# EAGLE design main (EAGLE 9.2.2)
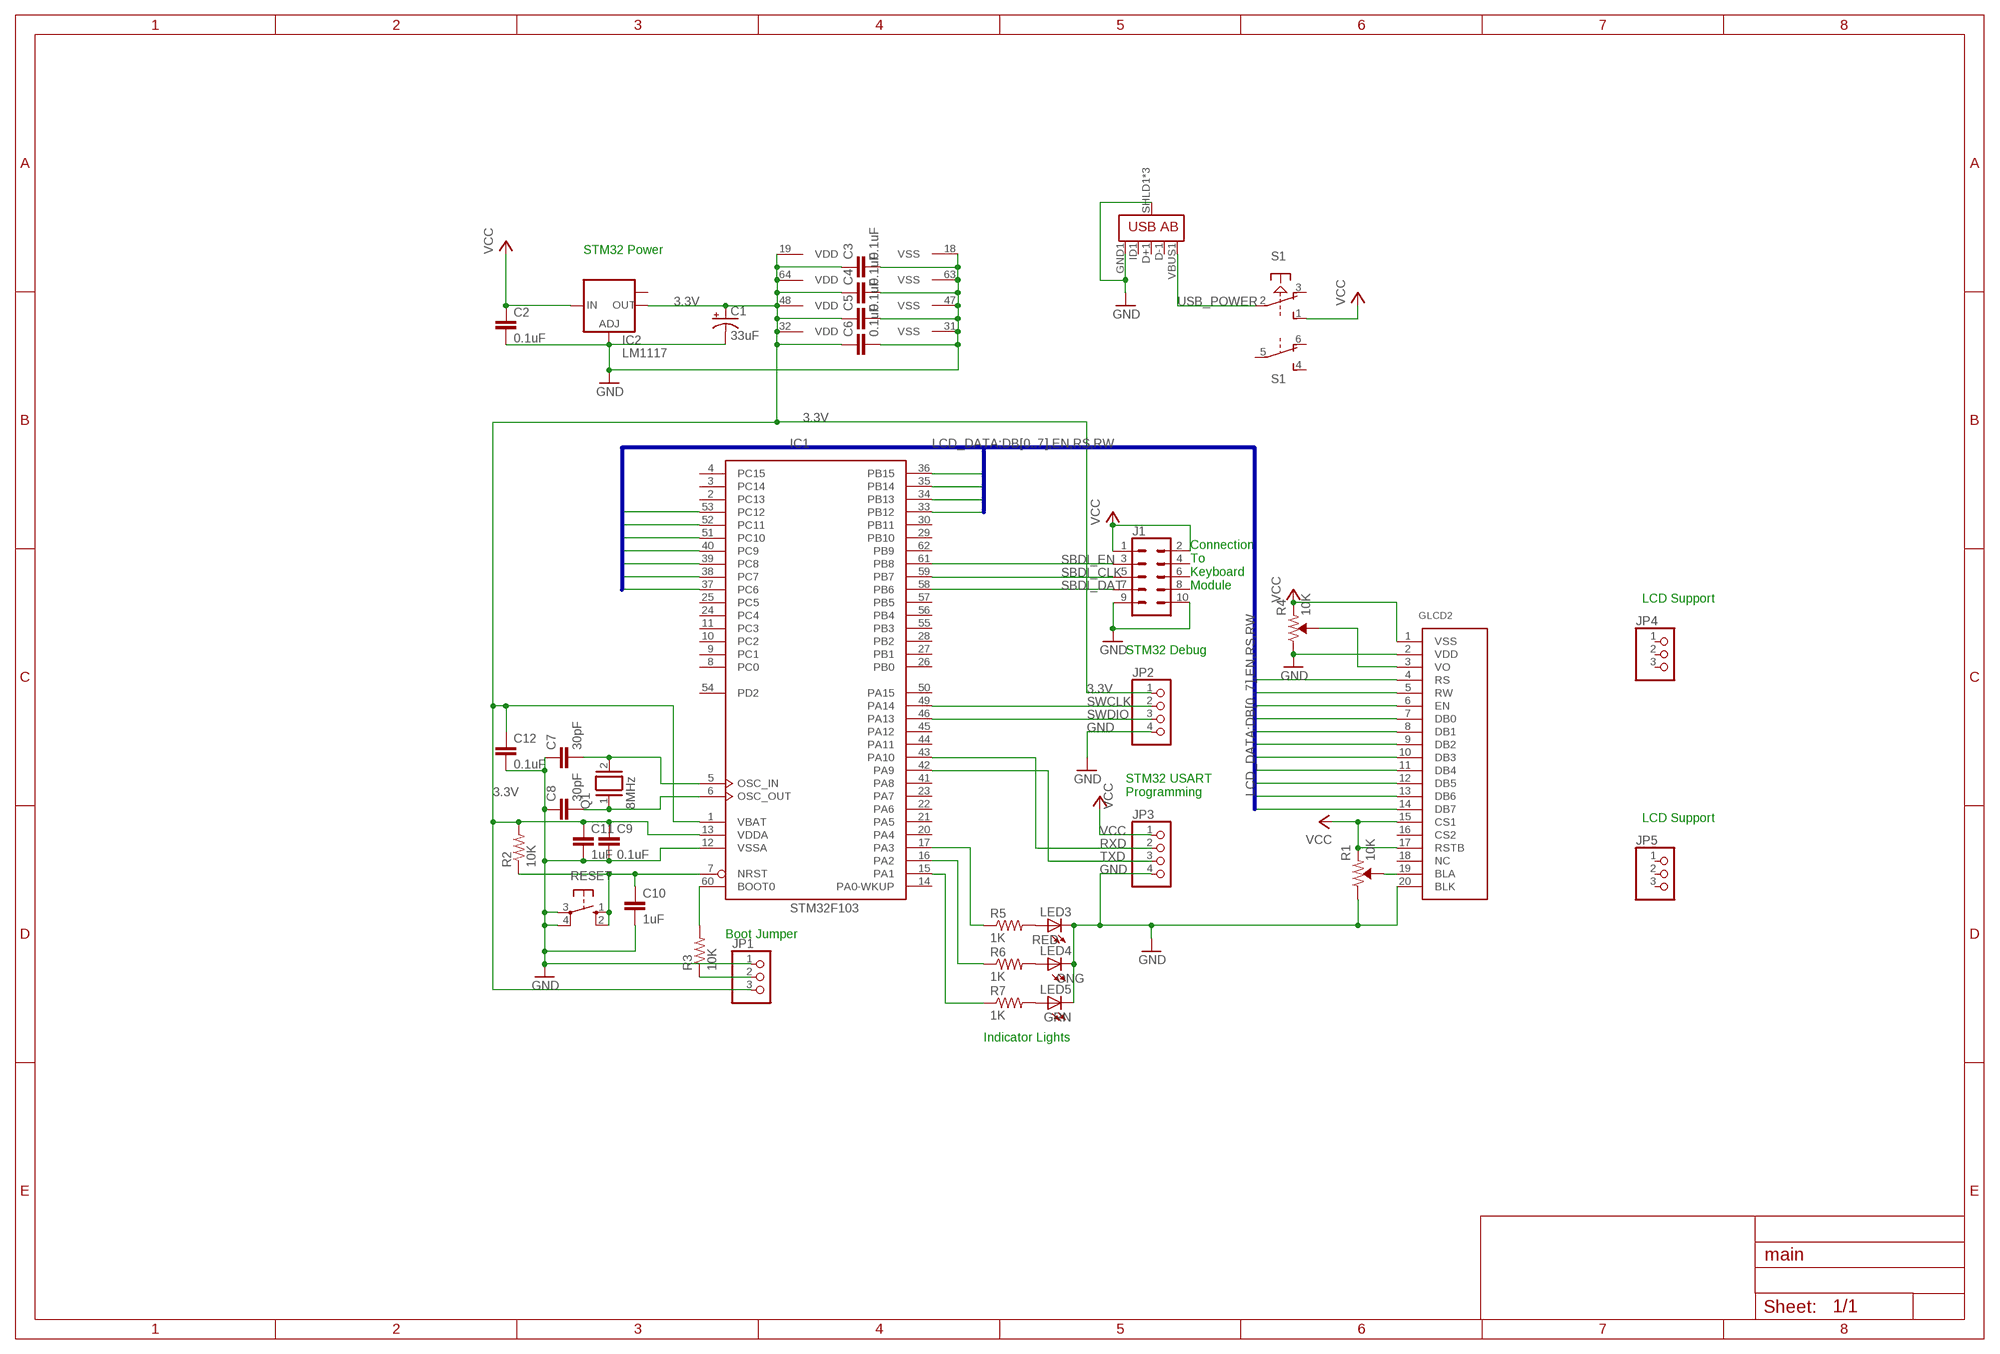
[diagram p0: schematic, sheet 1]

## Parts
C1  33uF  CPOL-USE2-5  [E2-5]
C2  0.1uF  C-EU025-025X050  [C025-025X050]
C3  0.1uF  C-EU025-025X050  [C025-025X050]
C4  0.1uF  C-EU025-025X050  [C025-025X050]
C5  0.1uF  C-EU025-025X050  [C025-025X050]
C6  0.1uF  C-EU025-025X050  [C025-025X050]
C7  30pF  C-EU025-025X050  [C025-025X050]
C8  30pF  C-EU025-025X050  [C025-025X050]
C9  0.1uF  C-EU025-025X050  [C025-025X050]
C10  1uF  C-EU025-025X050  [C025-025X050]
C11  1uF  C-EU025-025X050  [C025-025X050]
C12  0.1uF  C-EU025-025X050  [C025-025X050]
GLCD2  LCD128X64  [GLCD_TRULY_128X64_20_PINES]
IC1  STM32F103  STM32F103RCT  [LQFP64]
IC2  LM1117  LM1117IMPX-ADJ  [SOT223]
J1  CONN_05X2SHD_LOCK  [2X5-SHROUDED_LOCK]
JP1  PINHD-1X3  [1X03]
JP2  PINHD-1X4  [1X04]
JP3  PINHD-1X4  [1X04]
JP4  PINHD-1X3  [1X03]
JP5  PINHD-1X3  [1X03]
LED3  RED  LED5MM  [LED5MM]
LED4  ONG  LED5MM  [LED5MM]
LED5  GRN  LED5MM  [LED5MM]
Q1  8MHz  XTAL/S  [QS]
R1  10K  TRIMPOT-KNOB  [TRIMPOT-PTH-3386U]
R2  10K  R-US_0204/7  [0204/7]
R3  10K  R-US_0204/7  [0204/7]
R4  10K  TRIMPOT-KNOB  [TRIMPOT-PTH-3386U]
R5  1K  R-US_0204/7  [0204/7]
R6  1K  R-US_0204/7  [0204/7]
R7  1K  R-US_0204/7  [0204/7]
RESET  10-XX  [B3F-10XX]
S1  PVA2R  [PVA2R]
U1  USB_AB_SMT  [USB-AB-MICRO-SMD]

## Nets
3.3V: C1.+ C3.1 C4.1 C5.1 C6.1 C9.1 C11.1 C12.1 IC1.1(VBAT) IC1.13(VDDA) IC1.19(VDD) IC1.32(VDD) IC1.48(VDD) IC1.64(VDD) IC2.2(OUT) JP1.3 JP2.1 R2.2
DB0: GLCD2.7(DB0) IC1.33(PB12)
DB1: GLCD2.8(DB1) IC1.34(PB13)
DB2: GLCD2.9(DB2) IC1.35(PB14)
DB3: GLCD2.10(DB3) IC1.36(PB15)
DB4: GLCD2.11(DB4) IC1.37(PC6)
DB5: GLCD2.12(DB5) IC1.38(PC7)
DB6: GLCD2.13(DB6) IC1.39(PC8)
DB7: GLCD2.14(DB7) IC1.40(PC9)
EN: GLCD2.6(EN) IC1.53(PC12)
GND: C1.- C2.2 C3.2 C4.2 C5.2 C6.2 C7.1 C8.1 C9.2 C10.2 C11.2 C12.2 GLCD2.2(VDD) GLCD2.20(BLK) IC1.12(VSSA) IC1.18(VSS) IC1.31(VSS) IC1.47(VSS) IC1.63(VSS) IC2.1(ADJ) J1.9 J1.10 JP1.1 JP2.4 JP3.4 LED3.K(C) LED4.K(C) LED5.K(C) R1.1 R4.1 RESET.3(P) RESET.4(P1) U1.GND1(GND) U1.SHLD1(SHIELD) U1.SHLD2(SHIELD) U1.SHLD3(SHIELD)
N$1: GLCD2.19(BLA) R1.2
N$2: GLCD2.3(VO) R4.2
N$3: LED3.A R5.2
N$4: LED4.A R6.2
N$5: C7.2 IC1.5(OSC_IN) Q1.2
N$6: C10.1 IC1.7(NRST) R2.1 RESET.1(S) RESET.2(S1)
N$7: C8.2 IC1.6(OSC_OUT) Q1.1
N$9: IC1.15(PA1) R7.1
N$10: IC1.60(BOOT0) R3.2
N$11: JP1.2 R3.1
N$13: IC1.16(PA2) R6.1
N$14: IC1.17(PA3) R5.1
N$15: LED5.A R7.2
RS: GLCD2.4(RS) IC1.51(PC10)
RW: GLCD2.5(RW) IC1.52(PC11)
RXD: IC1.43(PA10) JP3.2
SBDI_CLK: IC1.59(PB7) J1.5
SBDI_DAT: IC1.58(PB6) J1.7
SBDI_EN: IC1.61(PB8) J1.3
SWCLK: IC1.49(PA14) JP2.2
SWDIO: IC1.46(PA13) JP2.3
TXD: IC1.42(PA9) JP3.3
USB_POWER: S1.2(1:P) U1.VBUS1(VBUS)
VCC: C2.1 GLCD2.1(VSS) GLCD2.15(CS1) GLCD2.17(RSTB) IC2.3(IN) J1.1 J1.2 JP3.1 R1.3 R4.3 S1.1(1:S)
Unconnected: GLCD2.16(CS2) GLCD2.18(NC) IC1.2(PC13) IC1.3(PC14) IC1.4(PC15) IC1.8(PC0) IC1.9(PC1) IC1.10(PC2) IC1.11(PC3) IC1.14(PA0-WKUP) IC1.20(PA4) IC1.21(PA5) IC1.22(PA6) IC1.23(PA7) IC1.24(PC4) IC1.25(PC5) IC1.26(PB0) IC1.27(PB1) IC1.28(PB2) IC1.29(PB10) IC1.30(PB11) IC1.41(PA8) IC1.44(PA11) IC1.45(PA12) IC1.50(PA15) IC1.54(PD2) IC1.55(PB3) IC1.56(PB4) IC1.57(PB5) IC1.62(PB9) IC2.TAB(OUT1) J1.4 J1.6 J1.8 JP4.1 JP4.2 JP4.3 JP5.1 JP5.2 JP5.3 S1.3(1:O) S1.4(2:S) S1.5(2:P) S1.6(2:O) U1.D+1(D+) U1.D-1(D-) U1.ID1(USBID)

## Buses
LCD_DATA:DB[0..7],EN,RS,RW

## Notes on the sheet
- STM32 Power
- Connection
  To
  Keyboard
  Module
- LCD Support
- STM32 Debug
- STM32 USART
  Programming
- LCD Support
- Boot Jumper
- Indicator Lights

## Library data of the parts
C1 = rcl:CPOL-US: POLARIZED CAPACITOR, American symbol; SPICEPREFIX: C
C2-C12 = rcl:C-EU: CAPACITOR, European symbol; SPICEPREFIX: C
GLCD2 = glcd_truly_128x64_20_pines:LCD128X64
IC1 = micro-stm_v3:STM32F103R*T: ARM 32-bit Cortex™-M3 CPU 72 MHz maximum frequency 16 to 1024 Kbytes of Flash memory 6 to 96 kbytes of SRAM 51 GPIOs 2.0 to 3.6 V application supply
IC2 = lm1117:LM1117IMPX-ADJ
J1 = SparkFun-Connectors:CONN_05X2: Multi connection point. Often used as Generic Header-pin footprint for 0.1 inch spaced/style header connections For AVR SPI programming port, see special device with nice symbol: "AVR_SPI_PROG_5x2.dev" You can populate with any combo of single row headers, but if you'd like an exact match, check these: 2x5 AVR ICSP Male Header <https://www.sparkfun.com/products/778> (PRT-00778) 2x5 Pin Shrouded Header <https://www.sparkfun.com/products/8506> (PRT-08506) On any of the 0.1 inch spaced packages, you can populate with these: Break Away Headers - Straight <https://www.sparkfun.com/products/116> (PRT-00116) Break Away Male Headers - Right Angle <https://www.sparkfun.com/products/553> (PRT-00553) Female Headers <https://www.sparkfun.com/products/115> (PRT-00115) Break Away Headers - Machine Pin <https://www.sparkfun.com/products/117> (PRT-00117) Break Away Female Headers - Swiss Machine Pin <https://www.sparkfun.com/products/743> (PRT-00743) Special note: the shrouded connector mates well with our 5x2 ribbon cables: 2x5 Pin IDC Ribbon Cable <https://www.sparkfun.com/products/8535> (PRT-08535); PROD_ID: CONN-08671; SF_ID: PRT-08506
JP1 JP4 JP5 = pinhead:PINHD-1X3: PIN HEADER
JP2 JP3 = pinhead:PINHD-1X4: PIN HEADER
LED3-LED5 = led:LED: LED OSRAM: - CHIPLED LG R971, LG N971, LY N971, LG Q971, LY Q971, LO R971, LY R971 LH N974, LH R974 LS Q976, LO Q976, LY Q976 LO Q996 - Hyper CHIPLED LW Q18S LB Q993, LB Q99A, LB R99A - SideLED LS A670, LO A670, LY A670, LG A670, LP A670 LB A673, LV A673, LT A673, LW A673 LH A674 LY A675 LS A676, LA A676, LO A676, LY A676, LW A676 LS A679, LY A679, LG A679 - Hyper Micro SIDELED® LS Y876, LA Y876, LO Y876, LY Y876 LT Y87S - SmartLED LW L88C, LW L88S LB L89C, LB L89S, LG L890 LS L89K, LO L89K, LY L89K LS L896, LA L896, LO L896, LY L896 - TOPLED LS T670, LO T670, LY T670, LG T670, LP T670 LSG T670, LSP T670, LSY T670, LOP T670, LYG T670 LG T671, LOG T671, LSG T671 LB T673, LV T673, LT T673, LW T673 LH T674 LS T676, LA T676, LO T676, LY T676, LB T676, LH T676, LSB T676, LW T676 LB T67C, LV T67C, LT T67C, LS T67K, LO T67K, LY T67K, LW E67C LS E67B, LA E67B, LO E67B, LY E67B, LB E67C, LV E67C, LT E67C LW T67C LS T679, LY T679, LG T679 LS T770, LO T770, LY T770, LG T770, LP T770 LB T773, LV T773, LT T773, LW T773 LH T774 LS E675, LA E675, LY E675, LS T675 LS T776, LA T776, LO T776, LY T776, LB T776 LHGB T686 LT T68C, LB T68C - Hyper Mini TOPLED® LB M676 - Mini TOPLED Santana® LG M470 LS M47K, LO M47K, LY M47K Source: http://www.osram.convergy.de LUXEON: - LUMILED® LXK2-PW12-R00, LXK2-PW12-S00, LXK2-PW14-U00, LXK2-PW14-V00 LXK2-PM12-R00, LXK2-PM12-S00, LXK2-PM14-U00 LXK2-PE12-Q00, LXK2-PE12-R00, LXK2-PE12-S00, LXK2-PE14-T00, LXK2-PE14-U00 LXK2-PB12-K00, LXK2-PB12-L00, LXK2-PB12-M00, LXK2-PB14-N00, LXK2-PB14-P00, LXK2-PB14-Q00 LXK2-PR12-L00, LXK2-PR12-M00, LXK2-PR14-Q00, LXK2-PR14-R00 LXK2-PD12-Q00, LXK2-PD12-R00, LXK2-PD12-S00 LXK2-PH12-R00, LXK2-PH12-S00 LXK2-PL12-P00, LXK2-PL12-Q00, LXK2-PL12-R00 Source: www.luxeon.com KINGBRIGHT: KA-3528ASYC Source: www.kingbright.com
Q1 = special:XTAL/S: CRYSTAL
R1 R4 = TCalc:TRIMPOT-KNOB
R2 R3 R5-R7 = rcl:R-US_: RESISTOR, American symbol; SPICEPREFIX: R
RESET = switch-omron:10-XX: OMRON SWITCH; MPN: B3F-1000; OC_FARNELL: 176432; OC_NEWARK: 36M3542
S1 = switch-misc:PVA2R: ITT SWITCH
U1 = SparkFun-Connectors:USB_AB: USB Type AB Micro Connector OTG-compatible. 5 pins, 3 shield pins SparkFun Products: IOIO-OTG <https://www.sparkfun.com/products/13613> SparkFun SAMD21 Mini Breakout <https://www.sparkfun.com/products/13664>; PROD_ID: CONN-11794

## Board
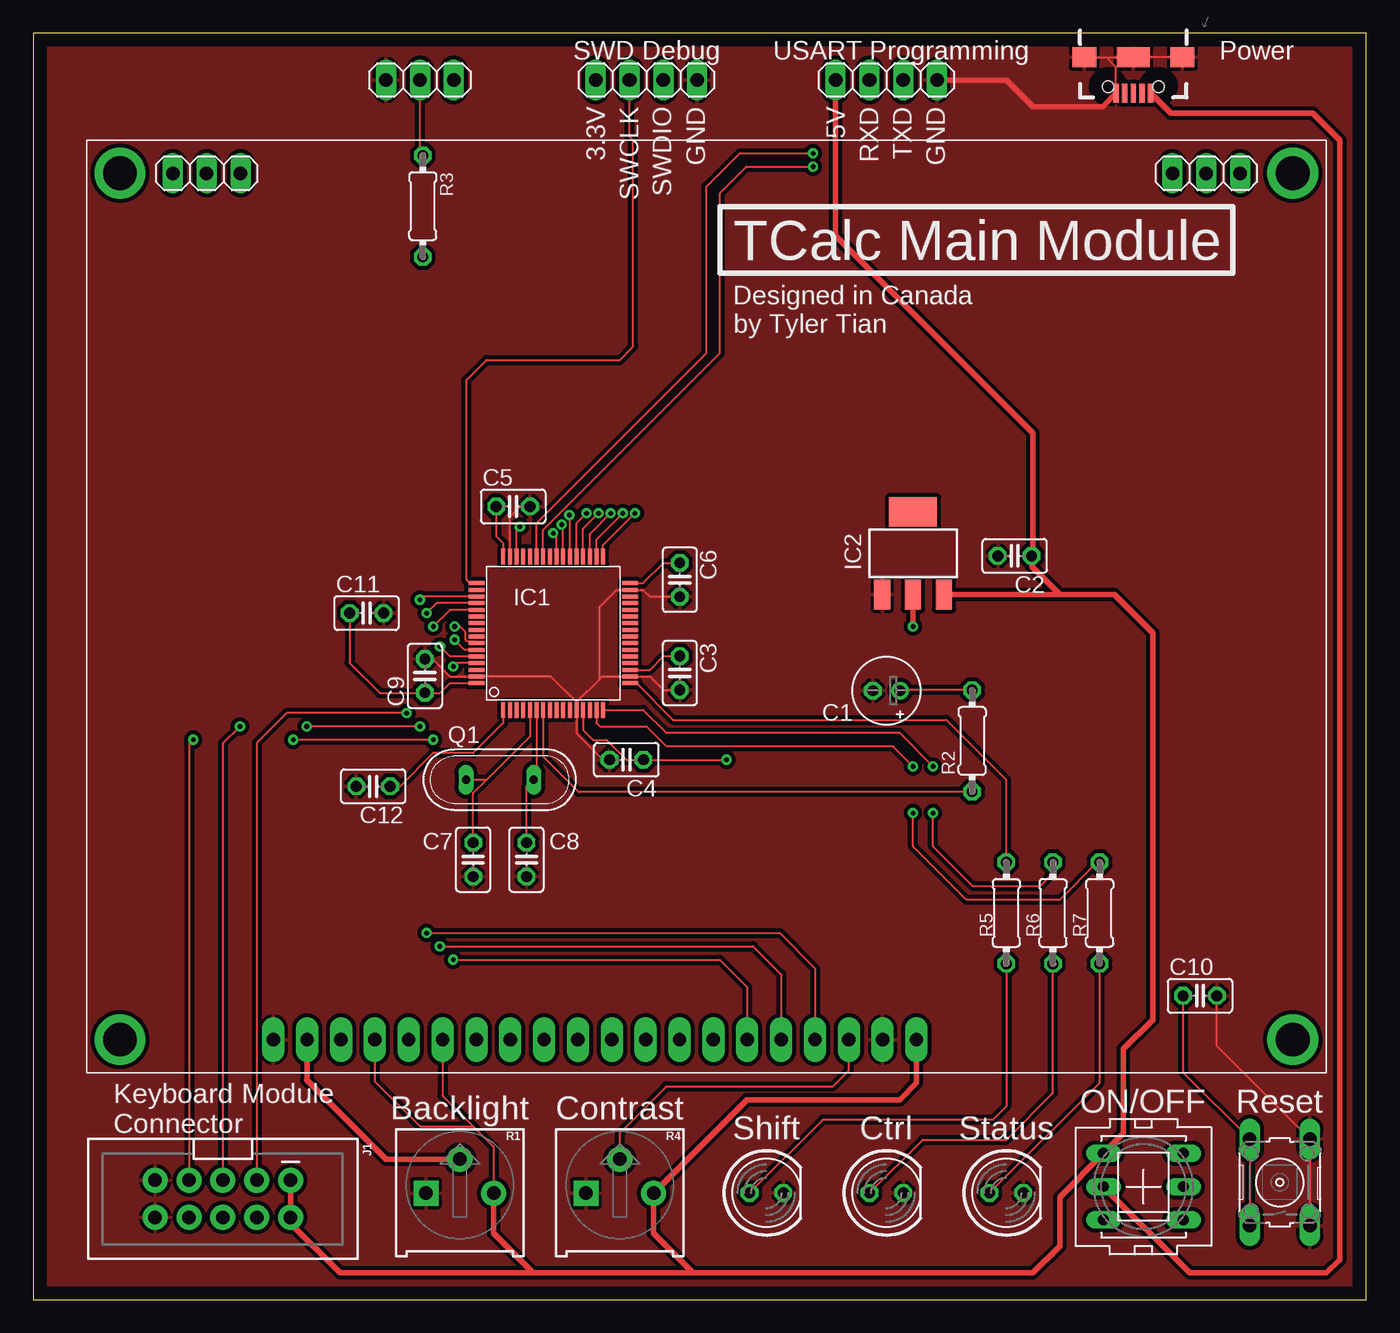
[diagram p1: board, top side]
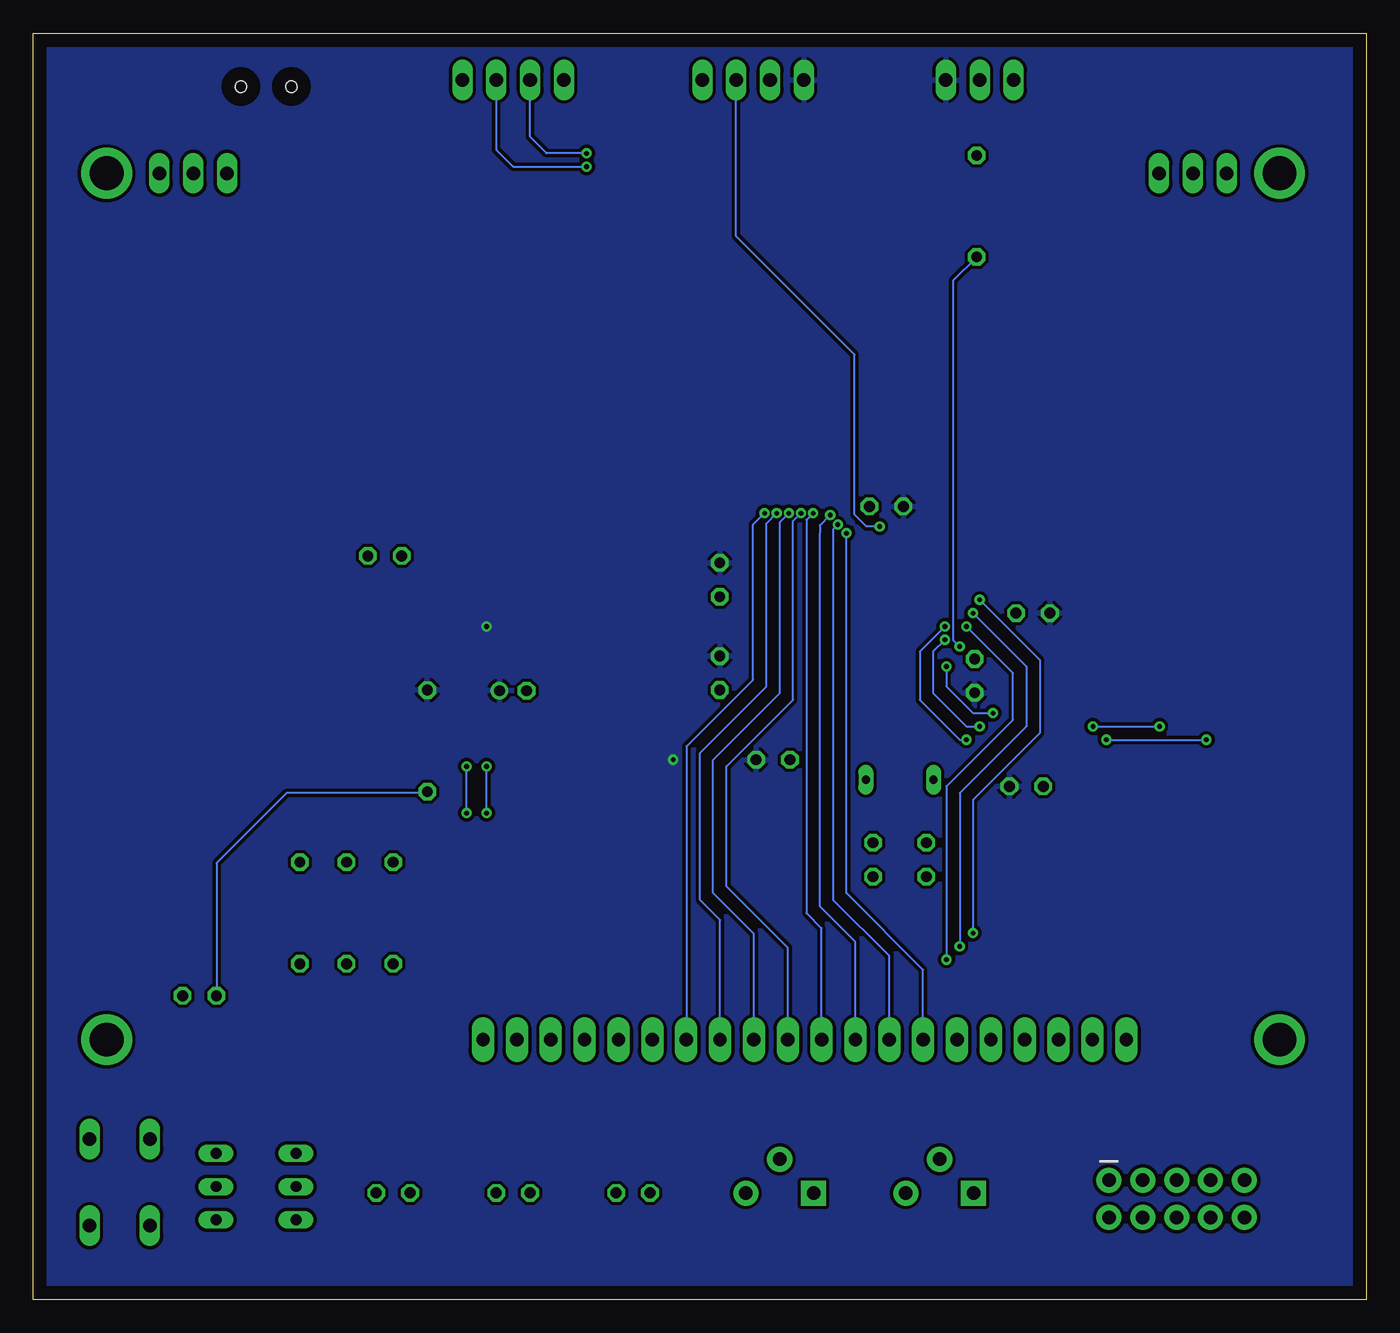
[diagram p2: board, bottom side, seen from below]

Size 100 x 95 mm. Coordinates in mm from the lower left corner, seen from the top.
Outline: 0,0 100,0 100,95 0,95 0,0
Copper layers (1*16): Top 0.035mm / dielectric 1.5mm / Bottom 0.035mm
Design rules "default": minimum track width 6mil, minimum drill 0.35mm, track to track 6mil, track to pad 6mil, pad to pad 6mil, via to via 6mil, smd to smd 6mil, copper to edge 40mil, drill to drill 6mil, minimum pad ring 10mil, minimum via ring 8mil, stop-mask expansion 4mil, vias tented up to drill 0mil, thermal gap 10mil

### Footprints (pad centres in the part's own frame; a part is rotated, then mirrored left to right if it is on the bottom)
E2-5 = drill 0.813 pad 1.27: + -1.016,0 | drill 0.813 pad 1.27 octagon: - 1.016,0
C025-025X050 = drill 0.813 octagon: 1 -1.27,0; 2 1.27,0
GLCD_TRULY_128X64_20_PINES = drill 1 pad 1.676 long: 1 62.26,2.5; 2 59.72,2.5; 3 57.18,2.5; 4 54.64,2.5; 5 52.1,2.5; 6 49.56,2.5; 7 47.02,2.5; 8 44.48,2.5; 9 41.94,2.5; 10 39.4,2.5; 11 36.86,2.5; 12 34.32,2.5; 13 31.78,2.5; 14 29.24,2.5; 15 26.7,2.5; 16 24.16,2.5; 17 21.62,2.5; 18 19.08,2.5; 19 16.54,2.5; 20 14,2.5 | drill 2.54 pad 3.81: P$21 2.5,2.5; P$22 90.5,2.5; P$23 90.5,67.5; P$24 2.5,67.5
LQFP64 = smd 0.3 x 1.2: 1 -3.75,-5.75; 2 -3.25,-5.75; 3 -2.75,-5.75; 4 -2.25,-5.75; 5 -1.75,-5.75; 6 -1.25,-5.75; 7 -0.75,-5.75; 8 -0.25,-5.75; 9 0.25,-5.75; 10 0.75,-5.75; 11 1.25,-5.75; 12 1.75,-5.75; 13 2.25,-5.75; 14 2.75,-5.75; 15 3.25,-5.75; 16 3.75,-5.75; 33 3.75,5.75; 34 3.25,5.75; 35 2.75,5.75; 36 2.25,5.75; 37 1.75,5.75; 38 1.25,5.75; 39 0.75,5.75; 40 0.25,5.75; 41 -0.25,5.75; 42 -0.75,5.75; 43 -1.25,5.75; 44 -1.75,5.75; 45 -2.25,5.75; 46 -2.75,5.75; 47 -3.25,5.75; 48 -3.75,5.75 | smd 1.2 x 0.3: 17 5.75,-3.75; 18 5.75,-3.25; 19 5.75,-2.75; 20 5.75,-2.25; 21 5.75,-1.75; 22 5.75,-1.25; 23 5.75,-0.75; 24 5.75,-0.25; 25 5.75,0.25; 26 5.75,0.75; 27 5.75,1.25; 28 5.75,1.75; 29 5.75,2.25; 30 5.75,2.75; 31 5.75,3.25; 32 5.75,3.75; 49 -5.75,3.75; 50 -5.75,3.25; 51 -5.75,2.75; 52 -5.75,2.25; 53 -5.75,1.75; 54 -5.75,1.25; 55 -5.75,0.75; 56 -5.75,0.25; 57 -5.75,-0.25; 58 -5.75,-0.75; 59 -5.75,-1.25; 60 -5.75,-1.75; 61 -5.75,-2.25; 62 -5.75,-2.75; 63 -5.75,-3.25; 64 -5.75,-3.75
SOT223 = smd 1.219 x 2.235: 1 -2.311,-3.099; 2 0,-3.099; 3 2.311,-3.099 | smd 3.6 x 2.2: TAB 0,3.099
2X5-SHROUDED_LOCK = drill 1.016 pad 1.88: 1 -1.397,5.08; 2 1.397,5.08; 3 -1.397,2.54; 4 1.397,2.54; 5 -1.397,0; 6 1.397,0; 7 -1.397,-2.54; 8 1.397,-2.54; 9 -1.397,-5.08; 10 1.397,-5.08
1X03 = drill 1.016 long: 1 -2.54,0; 2 0,0; 3 2.54,0
1X04 = drill 1.016 long: 1 -3.81,0; 2 -1.27,0; 3 1.27,0; 4 3.81,0
LED5MM = drill 0.813 octagon: A -1.27,0; K 1.27,0
QS = drill 0.61 long: 1 -2.54,0; 2 2.54,0
TRIMPOT-PTH-3386U = drill 1.016 pad 1.88 square: 1 -2.54,-0.015 | drill 1.016 pad 1.88: 2 0,2.525; 3 2.54,-0.015
0204/7 = drill 0.813 octagon: 1 -3.81,0; 2 3.81,0
B3F-10XX = drill 1.016 long: 1 -3.251,2.261; 2 3.251,2.261; 3 -3.251,-2.261; 4 3.251,-2.261
PVA2R = drill 0.813 long: 1 -2.997,2.489; 2 -2.997,0; 3 -2.997,-2.489; 4 2.997,2.489; 5 2.997,0; 6 2.997,-2.489
USB-AB-MICRO-SMD = smd 1.4 x 0.4: D+1 2.7,0; D-1 2.7,0.65; GND1 2.7,-1.3; ID1 2.7,-0.65; VBUS1 2.7,1.3 | smd 1.5 x 1.8: SHLD1 0,-3.68; SHLD2 0,3.68 | smd 1.5 x 2.5: SHLD3 0,0 | hole 0.85: 2.2,1.9; 2.2,-1.9

### Placement (x,y rotation side)
C1  64.01,45.68 180 top
C2  73.63,55.79 180 top
C3  48.5,47 270 top
C4  44.5,40.5 180 top
C5  36,59.5 0 top
C6  48.5,54 270 top
C7  33,33 90 top
C8  37,33 90 top
C9  29.38,46.79 90 top
C10  87.53,22.79 0 top
C11  25,51.5 0 top
C12  25.5,38.5 180 top
GLCD2  4,17 0 top
IC1  39,50 0 top
IC2  66,56 0 top
J1  14.22,7.55 270 top
JP1  29,91.5 0 top
JP2  46,91.5 0 top
JP3  64,91.5 0 top
JP4  88,84.5 0 top
JP5  13,84.5 0 top
LED3  55,8 0 top
LED4  64,8 0 top
LED5  73,8 0 top
Q1  35,39 180 top
R1  32,8 0 top
R2  70.44,41.91 90 top
R3  29.22,82.03 270 top
R4  44,8 0 top
R5  73,29 270 top
R6  76.5,29 270 top
R7  80,29 270 top
RESET  93.52,8.79 90 top
S1  83.29,8.47 0 top
U1  82.53,93.2 270 top

### Tracks (layer width: path | path; a pad name or v marks a point on that pad's centre or on a via)
3.3V  (via drill 0.35)
  Top 0.152: IC1.32 45.75,53.75 47.27,55.27 C6.1 | IC1.19 46.25,47.25 47.27,48.27 C3.1 | C5.1 34.73,57.27 35.25,56.75 IC1.48 | IC1.64 31.25,46.25 30.52,45.52 29.5,45.52 | IC1.13 41.25,42.75 42,42 43,42 44.5,40.5 C4.1 v52,40.5 | R2.2 65.07,45.72 C1.+ | IC1.1 35.25,43.25 33,41 30,41 27.5,38.5 C12.1 | C9.1 29.5,45.52 | C11.1 23.73,47.77 26,45.5 29.48,45.5 29.5,45.52
  Top 0.4: IC2.2 v66,50.5
  pour Bottom (isolate 0.25): 0,95 100,95 100,0 0,0
DB0  (via drill 0.35)
  Top 0.152: IC1.33 42.75,56.62 v45.13,59
  Bottom 0.152: v45.13,59 46,58.13 46,46.5 51,41.5 51,19.52 GLCD2.7
DB1  (via drill 0.35)
  Top 0.152: IC1.34 42.25,57.02 v44.23,59
  Bottom 0.152: GLCD2.8 48.48,28.48 50,30 50,41 45,46 45,58.23 v44.23,59
DB2  (via drill 0.35)
  Top 0.152: IC1.35 41.75,57.43 v43.32,59
  Bottom 0.152: GLCD2.9 45.94,27.44 49,30.5 49,40.5 44,45.5 44,58.32 v43.32,59
DB3  (via drill 0.35)
  Top 0.152: IC1.36 41.25,57.84 v42.41,59
  Bottom 0.152: GLCD2.10 43.4,26.4 48,31 48,40 43,45 43,58.41 v42.41,59
DB4  (via drill 0.35)
  Top 0.152: IC1.37 40.75,58.25 v41.5,59
  Bottom 0.152: v41.5,59 42,58.5 42,29 40.86,27.86 GLCD2.11
DB5  (via drill 0.35)
  Top 0.152: IC1.38 40.25,58.82 v40.21,58.86
  Bottom 0.152: GLCD2.12 38.32,26.82 41,29.5 41,57.5 41,58.07 v40.21,58.86
DB6  (via drill 0.35)
  Top 0.152: IC1.39 39.75,58.03 v39.64,58.14
  Bottom 0.152: GLCD2.13 35.78,25.78 40,30 40,57.78 v39.64,58.14
DB7  (via drill 0.35)
  Top 0.152: IC1.40 39.25,57.25 v39,57.5
  Bottom 0.152: GLCD2.14 33.24,24.74 39,30.5 v39,57.5
EN  (via drill 0.35)
  Top 0.152: IC1.53 31.25,51.75 v30,50.5 | GLCD2.6 53.56,23.44 51.5,25.5 v31.5,25.5
  Bottom 0.152: v30,50.5 26.5,47 26.5,43.5 31.5,38.5 v31.5,25.5
GND
  Top 0.152: RESET.3 RESET.4 88.8,19.02 C10.2 | C6.2 46.27,52.73 45.75,53.25 IC1.31 43.75,53.25 42.46,51.96 42.46,46.54 | C3.2 47.27,45.73 46.25,46.75 IC1.18 42.68,46.75 42.46,46.54 | IC1.47 35.75,58.75 36.5,59.5 C5.2 | C4.2 42.73,40.5 40.75,42.48 IC1.12 40.75,44.82 | C9.2 29.94,48.06 31.25,46.75 IC1.63 38.82,46.75 40.75,44.82 | U1.SHLD1 80.5,93.2 | 80.5,93.2 U1.SHLD3 U1.SHLD2 | U1.GND1 81.23,92.47 80.5,93.2 | 40.75,44.82 42.46,46.54
  Top 0.4: JP3.4 73,91.5 75,89.5 80.23,89.5 U1.GND1
  pour Top (isolate 0.3): 0,95 100,95 100,0 0,0
N$1
  Top 0.4: R1.2 26.48,10.53 20.5,16.5 20.54,16.54 GLCD2.19
N$2
  Top 0.152: R4.2 44,12.5 47.5,16 60,16 61.18,17.18 GLCD2.3
N$3
  Top 0.152: LED3.A 59.23,13.5 72,13.5 73,14.5 R5.2
N$4
  Top 0.152: LED4.A 66.73,12 73,12 76.5,15.5 R6.2
N$5
  Top 0.152: 34,39 37.25,42.25 IC1.5 | 34,39 Q1.2 | C7.2 33,38 34,39
N$6
  Top 0.152: RESET.1 RESET.2 86.26,17.04 C10.1 | R2.1 41,38.1 40.9,38.1 38.25,40.75 IC1.7
  Bottom 0.152: R2.1 70.54,38 81,38 86.26,32.74 C10.1
N$7
  Top 0.152: C8.2 37,38.46 37.27,38.73 Q1.1 37.75,39.21 IC1.6
N$9  (via drill 0.35)
  Top 0.152: IC1.15 42.25,43.25 42.5,43 46,43 47.5,41.5 64.5,41.5 v66,40 | R7.1 79.81,32.81 77,30 70,30 66,34 v66,36.5
  Bottom 0.152: v66,36.5 v66,40
N$10  (via drill 0.35)
  Top 0.152: IC1.60 31.25,48.25 v30.5,49
  Bottom 0.152: v30.5,49 31,49.5 31,76.44 R3.2
N$11
  Top 0.152: R3.1 29,86.06 JP1.2
N$13  (via drill 0.35)
  Top 0.152: R6.1 76.5,32 75.5,31 70.5,31 67.5,34 v67.5,36.5 | IC1.16 45.75,44.25 47.5,42.5 65,42.5 v67.5,40
  Bottom 0.152: v67.5,36.5 v67.5,40
N$14
  Top 0.152: R5.1 73,39 68.5,43.5 48,43.5 45.25,46.25 IC1.17
N$15
  Top 0.152: LED5.A 80,16.27 R7.2
RS  (via drill 0.35)
  Top 0.152: IC1.51 29.25,52.75 v29,52.5 | v29.5,27.5 56,27.5 58.64,24.86 GLCD2.4
  Bottom 0.152: v29,52.5 24.5,48 24.5,42.5 29.5,37.5 v29.5,27.5
RW  (via drill 0.35)
  Top 0.152: IC1.52 30.25,52.25 v29.5,51.5 | v30.5,26.5 54,26.5 56.1,24.4 GLCD2.5
  Bottom 0.152: v29.5,51.5 25.5,47.5 25.5,43 30.5,38 v30.5,26.5
RXD  (via drill 0.35)
  Top 0.152: IC1.43 37.75,58.25 50.5,71 50.5,83.5 53,86 v58.5,86
  Bottom 0.152: v58.5,86 61.5,86 62.73,87.23 JP3.2
SBDI_CLK  (via drill 0.35)
  Top 0.152: IC1.59 32.36,48.75 v31.61,49.5 | v29,43 v20.5,43 | v15.5,43 14.22,41.72 J1.5
  Bottom 0.152: v31.61,49.5 32.5,48.61 32.5,45.5 30,43 v29,43 | v20.5,43 v15.5,43
SBDI_DAT  (via drill 0.35)
  Top 0.152: IC1.58 33.13,49.37 32.55,49.37 32.42,49.51 32.42,50.08 32,50.5 v31.61,50.5 | v12,42 11.68,41.68 J1.7 | v30,42 v19.5,42
  Bottom 0.152: v31.61,50.5 33.5,48.61 33.5,45 30.5,42 v30,42 | v19.5,42 v12,42
SBDI_EN  (via drill 0.35)
  Top 0.152: IC1.61 31.75,47.75 v31.5,47.5 | v28,44 19,44 16.76,41.76 J1.3
  Bottom 0.152: v31.5,47.5 31.5,46 29.5,44 v28,44
SWCLK
  Top 0.152: IC1.49 32.75,53.75 32.5,54 32.5,63.5 32.5,69 34,70.5 44,70.5 45,71.5 45,87 44.73,87.27 JP2.2
SWDIO  (via drill 0.35)
  Top 0.152: IC1.46 36.25,57.75 v36.5,58
  Bottom 0.152: v36.5,58 37.5,58 38.39,58.89 38.39,70.89 47.27,79.77 JP2.3
TXD  (via drill 0.35)
  Top 0.152: IC1.42 38.25,57.75 40.5,60 51.5,71 51.5,83 53.5,85 v58.5,85
  Bottom 0.152: v58.5,85 64,85 65.27,86.27 JP3.3
USB_POWER
  Top 0.4: U1.VBUS1 85.33,89 96,89 98,87 98,3 97,2 86.76,2 S1.2
VCC
  Top 0.152: GLCD2.17 25.62,16.38 29,13 33,13 | 33,13 34.54,11.46 R1.3 | GLCD2.15 30.7,15.3 33,13
  Top 0.4: 77,52.9 81.1,52.9 84,50 84,21 81.79,18.79 81.79,12.46 S1.1 77,7.67 77,4 75,2 49.5,2 | 77,52.9 IC2.3 | 77,52.9 74.9,55 C2.1 75,55.89 75,65 60.19,79.81 JP3.1 | 49.5,2 37.5,2 | 37.5,2 23,2 19.3,5.7 J1.2 J1.1 | R1.3 34.54,4.96 37.5,2 | 49.5,2 46.54,4.96 R4.3 53.55,15 65,15 66.26,16.26 GLCD2.1

### Text on the board
tNames: SWD Debug | USART Programming | Power | 3.3V | SWCLK | SWDIO | GND | 5V | RXD | TXD | GND | TCalc Main Module | Designed in Canada / by Tyler Tian | Backlight | Contrast | ON/OFF | Reset | Keyboard Module / Connector | Shift | Ctrl | Status
tValues: BOOT0 | 0 | 1